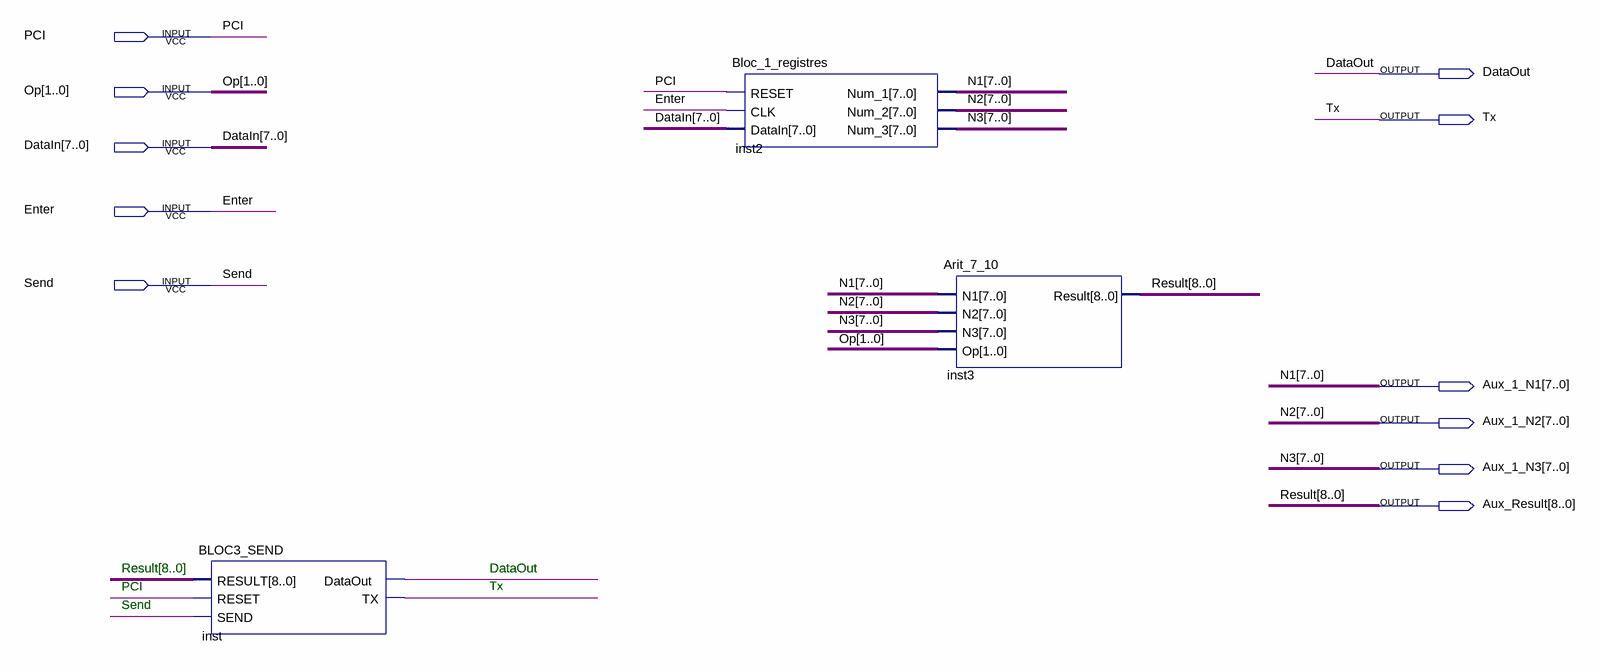
[diagram p0: schematic sheet]
// Quartus schematic registres.bdf as structural Verilog: 3 symbols, 11 pins
module registres (
  input  PCI,
  input  [1:0] Op,
  input  [7:0] DataIn,
  input  Enter,
  input  Send,
  output DataOut,
  output Tx,
  output [7:0] Aux_1_N1,
  output [7:0] Aux_1_N2,
  output [7:0] Aux_1_N3,
  output [8:0] Aux_Result
);

  BLOC3_SEND inst (.RESULT(Aux_Result), .RESET(PCI), .SEND(Send), .DataOut(DataOut), .TX(Tx));
  Bloc_1_registres inst2 (
    .RESET(PCI), .CLK(Enter), .DataIn(DataIn), .Num_1(Aux_1_N1), .Num_2(Aux_1_N2), .Num_3(Aux_1_N3));
  Arit_7_10 inst3 (.N1(Aux_1_N1), .N2(Aux_1_N2), .N3(Aux_1_N3), .Op(Op), .Result(Aux_Result));

  // Other names for the same wires on the sheet: N1[7:0] = Aux_1_N1; N2[7:0] = Aux_1_N2; N3[7:0] = Aux_1_N3;
  //   Result[8:0] = Aux_Result

  // Notes on the sheet:
  //   Result[8..0]
  //   DataOut
  //   PCI
  //   Tx
  //   Send
endmodule
